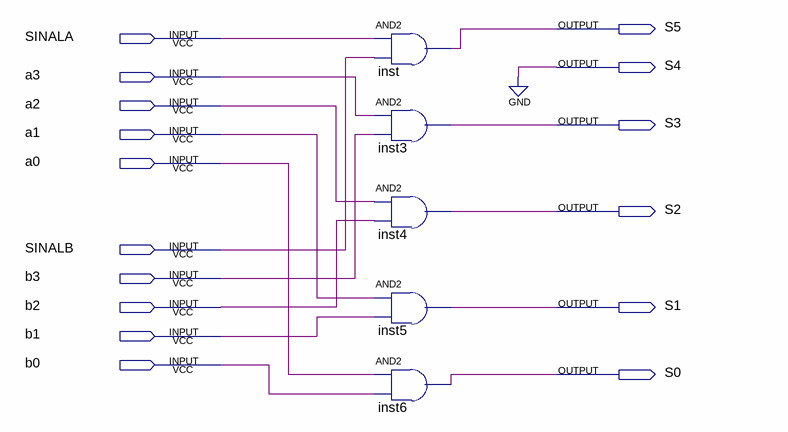
[diagram p0: schematic sheet]
// Quartus schematic END.bdf as structural Verilog: 5 symbols, 16 pins
module END (
  input  SINALA,
  input  a3,
  input  a2,
  input  a1,
  input  a0,
  input  SINALB,
  input  b3,
  input  b2,
  input  b1,
  input  b0,
  output S5,
  output S4,
  output S3,
  output S2,
  output S1,
  output S0
);

  and inst (S5, SINALA, SINALB);
  and inst3 (S3, a3, b3);
  and inst4 (S2, a2, b2);
  and inst5 (S1, a1, b1);
  and inst6 (S0, a0, b0);

  assign S4 = 1'b0;
endmodule
